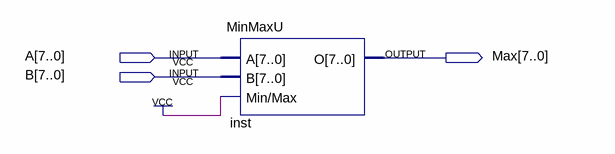
[diagram p0: schematic sheet]
// Quartus schematic MaxUnit.bdf as structural Verilog: 1 symbols, 3 pins
module MaxUnit (
  input  [7:0] A,
  input  [7:0] B,
  output [7:0] Max
);

  MinMaxU inst (.A(A), .B(B), .\Min/Max (1'b1), .O(Max));
endmodule
